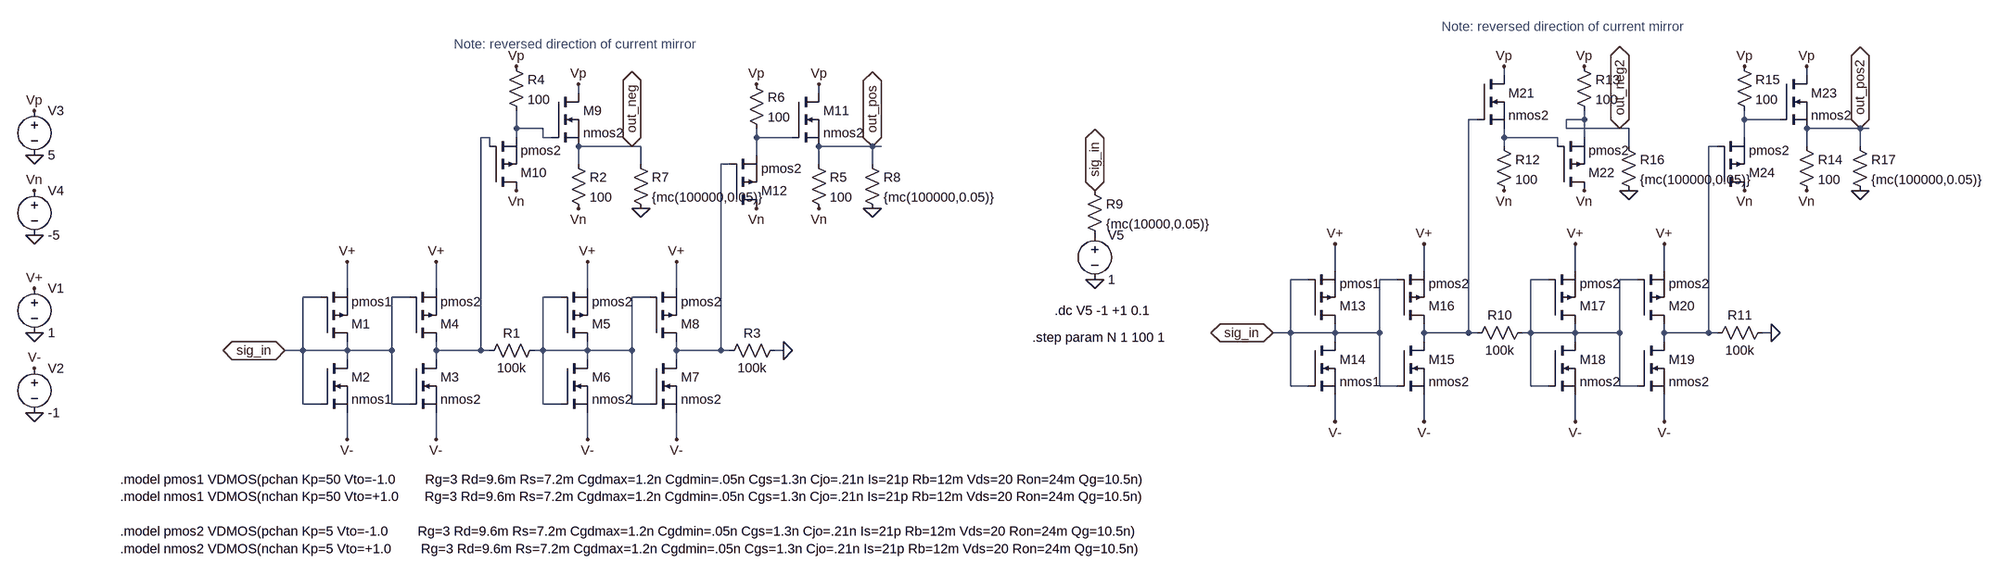
[diagram p0: schematic neuron_tanh_compare_matching.asc]
neuron_tanh_compare_matching.asc, the LTspice schematic file:
Version 4
SHEET 1 3352 680
WIRE 2464 -416 2464 -432
WIRE 3008 -416 3008 -432
WIRE 800 -384 800 -400
WIRE 1232 -384 1232 -400
WIRE 2416 -336 2400 -336
WIRE 2608 -336 2608 -352
WIRE 2608 -336 2576 -336
WIRE 2896 -336 2896 -352
WIRE 2960 -336 2896 -336
WIRE 688 -320 688 -352
WIRE 736 -320 688 -320
WIRE 2576 -320 2576 -336
WIRE 2672 -320 2576 -320
WIRE 2688 -320 2672 -320
WIRE 3104 -320 3008 -320
WIRE 3120 -320 3104 -320
WIRE 640 -304 624 -304
WIRE 688 -304 688 -320
WIRE 736 -304 736 -320
WIRE 752 -304 736 -304
WIRE 1120 -304 1120 -320
WIRE 1184 -304 1120 -304
WIRE 2464 -304 2464 -320
WIRE 2560 -304 2464 -304
WIRE 2608 -304 2608 -336
WIRE 2896 -304 2896 -336
WIRE 640 -288 640 -304
WIRE 896 -288 800 -288
WIRE 912 -288 896 -288
WIRE 1328 -288 1232 -288
WIRE 1344 -288 1328 -288
WIRE 2464 -288 2464 -304
WIRE 2560 -288 2560 -304
WIRE 2688 -288 2688 -320
WIRE 2848 -288 2832 -288
WIRE 3008 -288 3008 -320
WIRE 3104 -288 3104 -320
WIRE 1120 -272 1120 -304
WIRE 800 -256 800 -288
WIRE 912 -256 912 -288
WIRE 1072 -256 1056 -256
WIRE 1232 -256 1232 -288
WIRE 1328 -256 1328 -288
WIRE 2160 -64 2160 -112
WIRE 2320 -64 2320 -112
WIRE 2592 -64 2592 -112
WIRE 2752 -64 2752 -112
WIRE 2112 -48 2080 -48
WIRE 2272 -48 2240 -48
WIRE 2544 -48 2512 -48
WIRE 2704 -48 2672 -48
WIRE 384 -32 384 -80
WIRE 544 -32 544 -80
WIRE 816 -32 816 -80
WIRE 976 -32 976 -80
WIRE 336 -16 304 -16
WIRE 496 -16 464 -16
WIRE 768 -16 736 -16
WIRE 928 -16 896 -16
WIRE 2080 48 2080 -48
WIRE 2080 48 2048 48
WIRE 2160 48 2160 32
WIRE 2160 48 2080 48
WIRE 2240 48 2240 -48
WIRE 2240 48 2160 48
WIRE 2320 48 2320 32
WIRE 2400 48 2400 -336
WIRE 2400 48 2320 48
WIRE 2416 48 2400 48
WIRE 2512 48 2512 -48
WIRE 2512 48 2496 48
WIRE 2592 48 2592 32
WIRE 2592 48 2512 48
WIRE 2672 48 2672 -48
WIRE 2672 48 2592 48
WIRE 2752 48 2752 32
WIRE 2832 48 2832 -288
WIRE 2832 48 2752 48
WIRE 2848 48 2832 48
WIRE 2944 48 2928 48
WIRE 2160 64 2160 48
WIRE 2320 64 2320 48
WIRE 2592 64 2592 48
WIRE 2752 64 2752 48
WIRE 304 80 304 -16
WIRE 304 80 272 80
WIRE 384 80 384 64
WIRE 384 80 304 80
WIRE 464 80 464 -16
WIRE 464 80 384 80
WIRE 544 80 544 64
WIRE 624 80 624 -304
WIRE 624 80 544 80
WIRE 640 80 624 80
WIRE 736 80 736 -16
WIRE 736 80 720 80
WIRE 816 80 816 64
WIRE 816 80 736 80
WIRE 896 80 896 -16
WIRE 896 80 816 80
WIRE 976 80 976 64
WIRE 1056 80 1056 -256
WIRE 1056 80 976 80
WIRE 1072 80 1056 80
WIRE 1168 80 1152 80
WIRE 384 96 384 80
WIRE 544 96 544 80
WIRE 816 96 816 80
WIRE 976 96 976 80
WIRE 2080 144 2080 48
WIRE 2112 144 2080 144
WIRE 2240 144 2240 48
WIRE 2272 144 2240 144
WIRE 2512 144 2512 48
WIRE 2544 144 2512 144
WIRE 2672 144 2672 48
WIRE 2704 144 2672 144
WIRE 304 176 304 80
WIRE 336 176 304 176
WIRE 464 176 464 80
WIRE 496 176 464 176
WIRE 736 176 736 80
WIRE 768 176 736 176
WIRE 896 176 896 80
WIRE 928 176 896 176
WIRE 2160 208 2160 160
WIRE 2320 208 2320 160
WIRE 2592 208 2592 160
WIRE 2752 208 2752 160
WIRE 384 240 384 192
WIRE 544 240 544 192
WIRE 816 240 816 192
WIRE 976 240 976 192
FLAG -240 48 0
FLAG -240 -32 V+
FLAG -240 192 0
FLAG -240 112 V-
FLAG 384 -80 V+
FLAG 384 240 V-
FLAG 544 -80 V+
FLAG 544 240 V-
FLAG 1328 -288 out_pos
IOPIN 1328 -288 BiDir
FLAG 816 -80 V+
FLAG 816 240 V-
FLAG 976 -80 V+
FLAG 976 240 V-
FLAG 896 -288 out_neg
IOPIN 896 -288 BiDir
FLAG 1168 80 0
FLAG 272 80 sig_in
IOPIN 272 80 BiDir
FLAG -240 -272 0
FLAG -240 -352 Vp
FLAG -240 -128 0
FLAG -240 -208 Vn
FLAG 800 -400 Vp
FLAG 688 -432 Vp
FLAG 688 -208 Vn
FLAG 800 -176 Vn
FLAG 1232 -400 Vp
FLAG 1120 -400 Vp
FLAG 1120 -176 Vn
FLAG 1232 -176 Vn
FLAG 1728 -48 0
FLAG 1728 -208 sig_in
IOPIN 1728 -208 BiDir
FLAG 912 -176 0
FLAG 1328 -176 0
FLAG 2160 -112 V+
FLAG 2160 208 V-
FLAG 2320 -112 V+
FLAG 2320 208 V-
FLAG 3104 -320 out_pos2
IOPIN 3104 -320 BiDir
FLAG 2592 -112 V+
FLAG 2592 208 V-
FLAG 2752 -112 V+
FLAG 2752 208 V-
FLAG 2672 -320 out_neg2
IOPIN 2672 -320 BiDir
FLAG 2944 48 0
FLAG 2048 48 sig_in
IOPIN 2048 48 BiDir
FLAG 2464 -432 Vp
FLAG 2608 -432 Vp
FLAG 2608 -208 Vn
FLAG 2464 -208 Vn
FLAG 3008 -432 Vp
FLAG 2896 -432 Vp
FLAG 2896 -208 Vn
FLAG 3008 -208 Vn
FLAG 2688 -208 0
FLAG 3104 -208 0
SYMBOL pmos 336 64 M180
SYMATTR InstName M1
SYMATTR Value pmos1
SYMBOL voltage -240 -48 R0
WINDOW 123 0 0 Left 0
WINDOW 39 0 0 Left 0
SYMATTR InstName V1
SYMATTR Value 1
SYMBOL voltage -240 96 R0
WINDOW 123 0 0 Left 0
WINDOW 39 0 0 Left 0
SYMATTR InstName V2
SYMATTR Value -1
SYMBOL nmos 336 96 R0
SYMATTR InstName M2
SYMATTR Value nmos1
SYMBOL nmos 496 96 R0
SYMATTR InstName M3
SYMATTR Value nmos2
SYMBOL pmos 496 64 M180
SYMATTR InstName M4
SYMATTR Value pmos2
SYMBOL res 624 96 R270
WINDOW 0 32 56 VTop 2
WINDOW 3 0 56 VBottom 2
SYMATTR InstName R1
SYMATTR Value 100k
SYMBOL pmos 768 64 M180
SYMATTR InstName M5
SYMATTR Value pmos2
SYMBOL nmos 768 96 R0
SYMATTR InstName M6
SYMATTR Value nmos2
SYMBOL nmos 928 96 R0
SYMATTR InstName M7
SYMATTR Value nmos2
SYMBOL pmos 928 64 M180
SYMATTR InstName M8
SYMATTR Value pmos2
SYMBOL res 1056 96 R270
WINDOW 0 32 56 VTop 2
WINDOW 3 0 56 VBottom 2
SYMATTR InstName R3
SYMATTR Value 100k
SYMBOL nmos 752 -384 R0
SYMATTR InstName M9
SYMATTR Value nmos2
SYMBOL voltage -240 -368 R0
WINDOW 123 0 0 Left 0
WINDOW 39 0 0 Left 0
SYMATTR InstName V3
SYMATTR Value 5
SYMBOL voltage -240 -224 R0
WINDOW 123 0 0 Left 0
WINDOW 39 0 0 Left 0
SYMATTR InstName V4
SYMATTR Value -5
SYMBOL res 784 -272 R0
SYMATTR InstName R2
SYMATTR Value 100
SYMBOL pmos 640 -208 M180
SYMATTR InstName M10
SYMATTR Value pmos2
SYMBOL res 672 -448 R0
SYMATTR InstName R4
SYMATTR Value 100
SYMBOL nmos 1184 -384 R0
SYMATTR InstName M11
SYMATTR Value nmos2
SYMBOL res 1216 -272 R0
SYMATTR InstName R5
SYMATTR Value 100
SYMBOL pmos 1072 -176 M180
SYMATTR InstName M12
SYMATTR Value pmos2
SYMBOL res 1104 -416 R0
SYMATTR InstName R6
SYMATTR Value 100
SYMBOL voltage 1728 -144 R0
WINDOW 123 0 0 Left 0
WINDOW 39 0 0 Left 0
SYMATTR InstName V5
SYMATTR Value 1
SYMBOL res 896 -272 R0
SYMATTR InstName R7
SYMATTR Value {mc(100000,0.05)}
SYMBOL res 1312 -272 R0
SYMATTR InstName R8
SYMATTR Value {mc(100000,0.05)}
SYMBOL res 1712 -224 R0
SYMATTR InstName R9
SYMATTR Value {mc(10000,0.05)}
SYMBOL pmos 2112 32 M180
SYMATTR InstName M13
SYMATTR Value pmos1
SYMBOL nmos 2112 64 R0
SYMATTR InstName M14
SYMATTR Value nmos1
SYMBOL nmos 2272 64 R0
SYMATTR InstName M15
SYMATTR Value nmos2
SYMBOL pmos 2272 32 M180
SYMATTR InstName M16
SYMATTR Value pmos2
SYMBOL res 2400 64 R270
WINDOW 0 32 56 VTop 2
WINDOW 3 0 56 VBottom 2
SYMATTR InstName R10
SYMATTR Value 100k
SYMBOL pmos 2544 32 M180
SYMATTR InstName M17
SYMATTR Value pmos2
SYMBOL nmos 2544 64 R0
SYMATTR InstName M18
SYMATTR Value nmos2
SYMBOL nmos 2704 64 R0
SYMATTR InstName M19
SYMATTR Value nmos2
SYMBOL pmos 2704 32 M180
SYMATTR InstName M20
SYMATTR Value pmos2
SYMBOL res 2832 64 R270
WINDOW 0 32 56 VTop 2
WINDOW 3 0 56 VBottom 2
SYMATTR InstName R11
SYMATTR Value 100k
SYMBOL nmos 2416 -416 R0
SYMATTR InstName M21
SYMATTR Value nmos2
SYMBOL res 2448 -304 R0
SYMATTR InstName R12
SYMATTR Value 100
SYMBOL pmos 2560 -208 M180
SYMATTR InstName M22
SYMATTR Value pmos2
SYMBOL res 2592 -448 R0
SYMATTR InstName R13
SYMATTR Value 100
SYMBOL nmos 2960 -416 R0
SYMATTR InstName M23
SYMATTR Value nmos2
SYMBOL res 2992 -304 R0
SYMATTR InstName R14
SYMATTR Value 100
SYMBOL pmos 2848 -208 M180
SYMATTR InstName M24
SYMATTR Value pmos2
SYMBOL res 2880 -448 R0
SYMATTR InstName R15
SYMATTR Value 100
SYMBOL res 2672 -304 R0
SYMATTR InstName R16
SYMATTR Value {mc(100000,0.05)}
SYMBOL res 3088 -304 R0
SYMATTR InstName R17
SYMATTR Value {mc(100000,0.05)}
TEXT -24 312 Left 2 !.model pmos1 VDMOS(pchan Kp=50 Vto=-1.0        Rg=3 Rd=9.6m Rs=7.2m Cgdmax=1.2n Cgdmin=.05n Cgs=1.3n Cjo=.21n Is=21p Rb=12m Vds=20 Ron=24m Qg=10.5n)\n.model nmos1 VDMOS(nchan Kp=50 Vto=+1.0       Rg=3 Rd=9.6m Rs=7.2m Cgdmax=1.2n Cgdmin=.05n Cgs=1.3n Cjo=.21n Is=21p Rb=12m Vds=20 Ron=24m Qg=10.5n)\n \n.model pmos2 VDMOS(pchan Kp=5 Vto=-1.0        Rg=3 Rd=9.6m Rs=7.2m Cgdmax=1.2n Cgdmin=.05n Cgs=1.3n Cjo=.21n Is=21p Rb=12m Vds=20 Ron=24m Qg=10.5n)\n.model nmos2 VDMOS(nchan Kp=5 Vto=+1.0        Rg=3 Rd=9.6m Rs=7.2m Cgdmax=1.2n Cgdmin=.05n Cgs=1.3n Cjo=.21n Is=21p Rb=12m Vds=20 Ron=24m Qg=10.5n)
TEXT 576 -472 Left 2 ;Note: reversed direction of current mirror
TEXT 1656 8 Left 2 !.dc V5 -1 +1 0.1
TEXT 2352 -504 Left 2 ;Note: reversed direction of current mirror
TEXT 1616 56 Left 2 !.step param N 1 100 1

The netlist it stands for:
* neuron_tanh_compare_matching.asc
M1 sig_in sig_in V+ V+ pmos1
V1 V+ 0 1
V2 V- 0 -1
M2 sig_in sig_in V- V- nmos1
M3 N004 sig_in V- V- nmos2
M4 N004 sig_in V+ V+ pmos2
R1 N004 N010 100k
M5 N010 N010 V+ V+ pmos2
M6 N010 N010 V- V- nmos2
M7 N008 N010 V- V- nmos2
M8 N008 N010 V+ V+ pmos2
R3 N008 0 100k
M9 Vp N003 out_neg out_neg nmos2
V3 Vp 0 5
V4 Vn 0 -5
R2 out_neg Vn 100
M10 Vn N004 N003 N003 pmos2
R4 Vp N003 100
M11 Vp N005 out_pos out_pos nmos2
R5 out_pos Vn 100
M12 Vn N008 N005 N005 pmos2
R6 Vp N005 100
V5 P001 0 1
R7 out_neg 0 {mc(100000,0.05)}
R8 out_pos 0 {mc(100000,0.05)}
R9 sig_in P001 {mc(10000,0.05)}
M13 sig_in sig_in V+ V+ pmos1
M14 sig_in sig_in V- V- nmos1
M15 N001 sig_in V- V- nmos2
M16 N001 sig_in V+ V+ pmos2
R10 N001 N009 100k
M17 N009 N009 V+ V+ pmos2
M18 N009 N009 V- V- nmos2
M19 N007 N009 V- V- nmos2
M20 N007 N009 V+ V+ pmos2
R11 N007 0 100k
M21 Vp N001 N006 N006 nmos2
R12 N006 Vn 100
M22 Vn N006 out_neg2 out_neg2 pmos2
R13 Vp out_neg2 100
M23 Vp N002 out_pos2 out_pos2 nmos2
R14 out_pos2 Vn 100
M24 Vn N007 N002 N002 pmos2
R15 Vp N002 100
R16 out_neg2 0 {mc(100000,0.05)}
R17 out_pos2 0 {mc(100000,0.05)}
.model NMOS NMOS
.model PMOS PMOS
.lib standard.mos
.model pmos1 VDMOS(pchan Kp=50 Vto=-1.0        Rg=3 Rd=9.6m Rs=7.2m Cgdmax=1.2n Cgdmin=.05n Cgs=1.3n Cjo=.21n Is=21p Rb=12m Vds=20 Ron=24m Qg=10.5n)
.model nmos1 VDMOS(nchan Kp=50 Vto=+1.0       Rg=3 Rd=9.6m Rs=7.2m Cgdmax=1.2n Cgdmin=.05n Cgs=1.3n Cjo=.21n Is=21p Rb=12m Vds=20 Ron=24m Qg=10.5n)
.model pmos2 VDMOS(pchan Kp=5 Vto=-1.0        Rg=3 Rd=9.6m Rs=7.2m Cgdmax=1.2n Cgdmin=.05n Cgs=1.3n Cjo=.21n Is=21p Rb=12m Vds=20 Ron=24m Qg=10.5n)
.model nmos2 VDMOS(nchan Kp=5 Vto=+1.0        Rg=3 Rd=9.6m Rs=7.2m Cgdmax=1.2n Cgdmin=.05n Cgs=1.3n Cjo=.21n Is=21p Rb=12m Vds=20 Ron=24m Qg=10.5n)
* Note: reversed direction of current mirror
.dc V5 -1 +1 0.1
* Note: reversed direction of current mirror
.step param N 1 100 1
.backanno
.end